# Altium schematic sheet 原理图.SchDoc
size A3
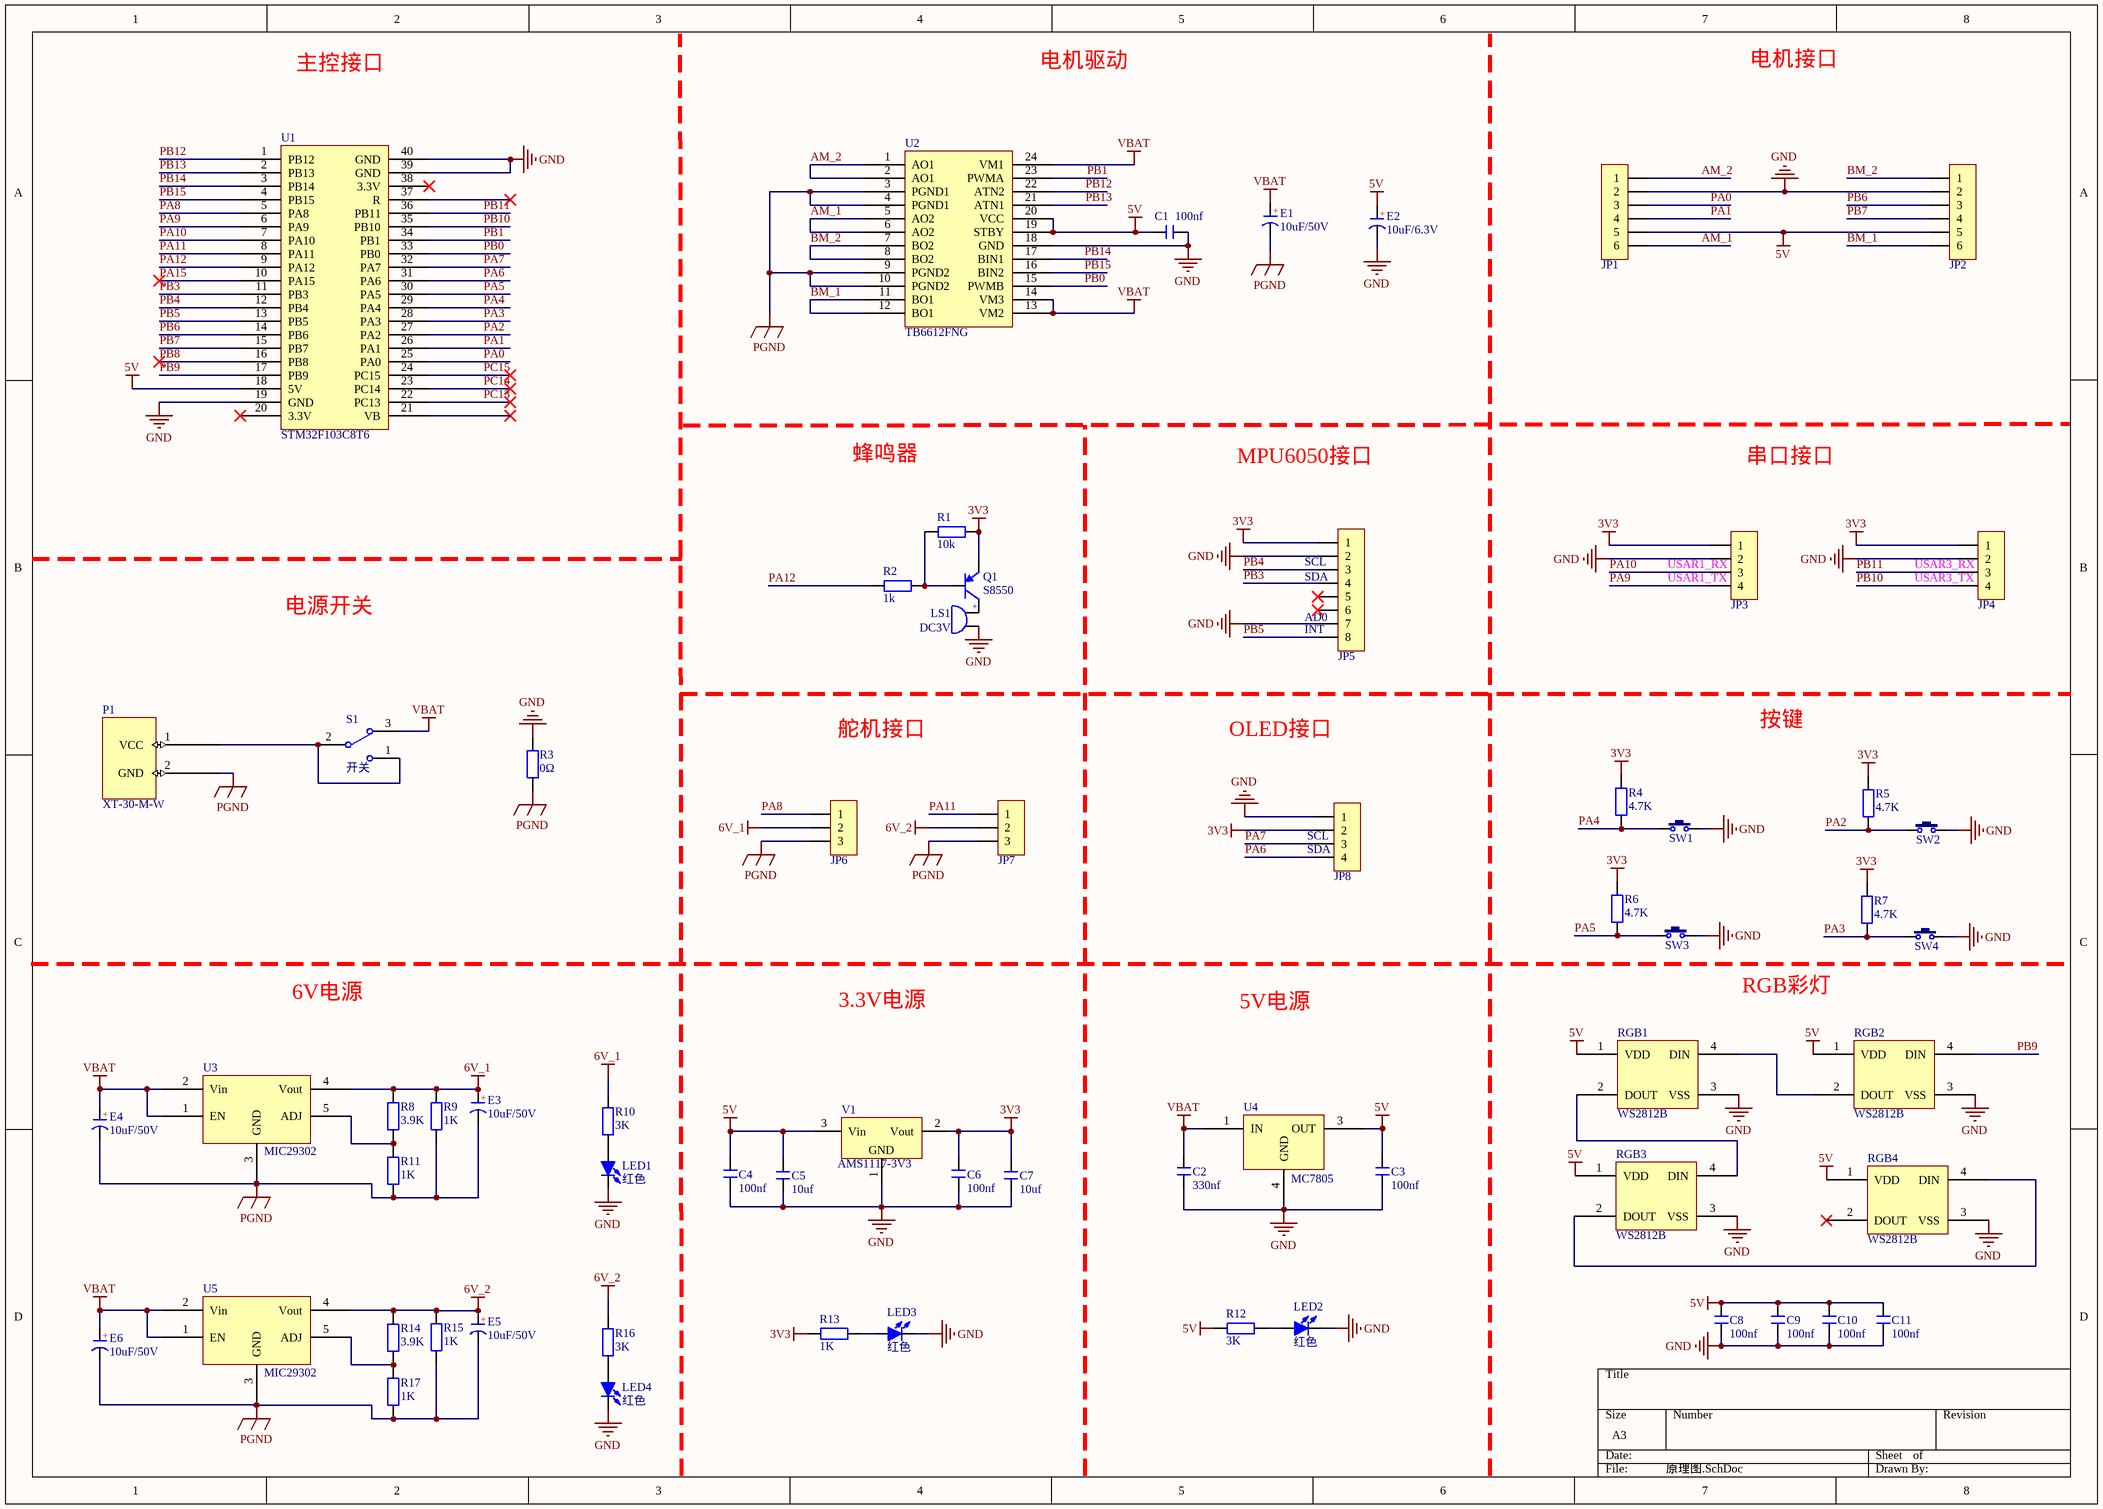
[diagram p0: 原理图.SchDoc]

## Parts
C1  100nf  [C 0805_L]
C2  330nf  [C 0805_L]
C3  100nf  [C 0805_L]
C4  100nf  [C 0805_L]
C5  10uf  [C 0805_L]
C6  100nf  [C 0805_L]
C7  10uf  [C 0805_L]
C8  100nf  [C 0805_L]
C9  100nf  [C 0805_L]
C10  100nf  [C 0805_L]
C11  100nf  [C 0805_L]
E1  10uF/50V  [CM C(5*5.4)]
E2  10uF/6.3V  [CD A(3216)]
E3  10uF/50V  [CS 2.0*5*8 - V]
E4  10uF/50V  [CS 2.0*5*8 - V]
E5  10uF/50V  [CS 2.0*5*8 - V]
E6  10uF/50V  [CS 2.0*5*8 - V]
JP1  HDR-1X6  [XH2.54-WI-6P]  (value not drawn)
JP2  HDR-1X6  [XH2.54-WI-6P]  (value not drawn)
JP3  HDR-1X4  [HDR2.54-M-LI-4P]  (value not drawn)
JP4  HDR-1X4  [HDR2.54-M-LI-4P]  (value not drawn)
JP5  HDR-1X8  [HDR2.54-M-LI-8P]  (value not drawn)
JP6  HDR-1X3  [HDR2.54-LI-3P]  (value not drawn)
JP7  HDR-1X3  [HDR2.54-LI-3P]  (value not drawn)
JP8  HDR-1X4  [HDR2.54-M-LI-4P]  (value not drawn)
LED1  红色  [LED 0603B]
LED2  红色  [LED 0603B]
LED3  红色  [LED 0603B]
LED4  红色  [LED 0603B]
LS1  DC3V  [BEEP 5x9x5.5]
P1  XT-30-M-W  [XT-30-M-W]
Q1  S8550  [SOT23-3N]
R1  10k  [R 0805_L]
R2  1k  [R 0805_L]
R3  0Ω  [R 0805_L]
R4  4.7K  [R 0805_L]
R5  4.7K  [R 0805_L]
R6  4.7K  [R 0805_L]
R7  4.7K  [R 0805_L]
R8  3.9K  [R 0805_L]
R9  1K  [R 0805_L]
R10  3K  [R 0805_L]
R11  1K  [R 0805_L]
R12  3K  [R 0805_L]
R13  1K  [R 0805_L]
R14  3.9K  [R 0805_L]
R15  1K  [R 0805_L]
R16  3K  [R 0805_L]
R17  1K  [R 0805_L]
RGB1  WS2812B  [WS2812B]
RGB2  WS2812B  [WS2812B]
RGB3  WS2812B  [WS2812B]
RGB4  WS2812B  [WS2812B]
S1  开关  [MTS-10x]
SW1  3x6x5  [TSW SMD-3*6*2.5]  (value not drawn)
SW2  3x6x5  [TSW SMD-3*6*2.5]  (value not drawn)
SW3  3x6x5  [TSW SMD-3*6*2.5]  (value not drawn)
SW4  3x6x5  [TSW SMD-3*6*2.5]  (value not drawn)
U1  STM32F103C8T6  [STM32F103C8T6最小系统板3]
U2  TB6612FNG  [SSOP24_L]
U3  MIC29302  [TO-263-5]
U4  MC7805  [TO-263-3]
U5  MIC29302  [TO-263-5]
V1  AMS1117-3V3  [SOT223_L]

## Nets
3V3: C6.2 C7.2 JP3.1 JP4.1 JP5.1 JP8.2 Q1.2(E) R1.1 R4.1 R5.1 R6.1 R7.1 R13.1 V1.2(Vout)
5V: C1.2 C3.2 C4.2 C5.2 C8.2 C9.2 C10.2 C11.2 E2.1(A) JP1.5 JP2.5 R12.1 RGB1.1(VDD) RGB2.1(VDD) RGB3.1(VDD) RGB4.1(VDD) U1.18(5V) U2.19(STBY) U2.20(VCC) U4.3(OUT) V1.3(Vin)
6V_1: E3.1(A) JP6.2 R8.1 R9.1 R10.1 U3.4(Vout)
6V_2: E5.1(A) JP7.2 R14.1 R15.1 R16.1 U5.4(Vout)
GND: C1.1 C2.1 C3.1 C4.1 C5.1 C6.1 C7.1 C8.1 C9.1 C10.1 C11.1 E2.2(K) JP1.2 JP2.2 JP3.2 JP4.2 JP5.2 JP5.7 JP8.1 LED1.2(K) LED2.2(K) LED3.2(K) LED4.2(K) LS1.2 R3.2 RGB1.3(VSS) RGB2.3(VSS) RGB3.3(VSS) RGB4.3(VSS) SW1.2 SW2.2 SW3.2 SW4.2 U1.19(GND) U1.39(GND) U1.40(GND) U2.18(GND) U4.4(GND) V1.1(GND)
PGND: E1.2(K) E3.2(K) E4.2(K) E5.2(K) E6.2(K) JP6.3 JP7.3 P1.2(GND) R3.1 R9.2 R11.1 R15.2 R17.1 U2.3(PGND1) U2.4(PGND1) U2.9(PGND2) U2.10(PGND2) U3.3(GND) U5.3(GND)
VBAT: C2.2 E1.1(A) E4.1(A) E6.1(A) S1.3 U2.13(VM2) U2.14(VM3) U2.24(VM1) U3.1(EN) U3.2(Vin) U4.1(IN) U5.1(EN) U5.2(Vin)
AM_1: JP1.6 U2.5(AO2) U2.6(AO2)
AM_2: JP1.1 U2.1(AO1) U2.2(AO1)
BM_1: JP2.6 U2.11(BO1) U2.12(BO1)
BM_2: JP2.1 U2.7(BO2) U2.8(BO2)
PA0: JP1.3 U1.25(PA0)
PA1: JP1.4 U1.26(PA1)
PA2: R5.2 SW2.1 U1.27(PA2)
PA3: R7.2 SW4.1 U1.28(PA3)
PA4: R4.2 SW1.1 U1.29(PA4)
PA5: R6.2 SW3.1 U1.30(PA5)
PA6: JP8.4 U1.31(PA6)
PA7: JP8.3 U1.32(PA7)
PA8: JP6.1 U1.5(PA8)
PA9: JP3.4 U1.6(PA9)
PA10: JP3.3 U1.7(PA10)
PA11: JP7.1 U1.8(PA11)
PA12: R2.1 U1.9(PA12)
PA15: U1.10(PA15)
PB0: U1.33(PB0) U2.15(PWMB)
PB1: U1.34(PB1) U2.23(PWMA)
PB3: JP5.4 U1.11(PB3)
PB4: JP5.3 U1.12(PB4)
PB5: JP5.8 U1.13(PB5)
PB6: JP2.3 U1.14(PB6)
PB7: JP2.4 U1.15(PB7)
PB8: U1.16(PB8)
PB9: RGB2.4(DIN) U1.17(PB9)
PB10: JP4.4 U1.35(PB10)
PB11: JP4.3 U1.36(PB11)
PB12: U1.1(PB12) U2.22(ATN2)
PB13: U1.2(PB13) U2.21(ATN1)
PB14: U1.3(PB14) U2.17(BIN1)
PB15: U1.4(PB15) U2.16(BIN2)
PC13: U1.22(PC13)
PC14: U1.23(PC14)
PC15: U1.24(PC15)
NetLED1_1: LED1.1(A) R10.2
NetLED2_1: LED2.1(A) R12.2
NetLED3_1: LED3.1(A) R13.2
NetLED4_1: LED4.1(A) R16.2
NetLS1_1: LS1.1 Q1.3(C)
NetP1_1: P1.1(VCC) S1.1 S1.2
NetQ1_1: Q1.1(B) R1.2 R2.2
NetR8_2: R8.2 R11.2 U3.5(ADJ)
NetR14_2: R14.2 R17.2 U5.5(ADJ)
NetRGB1_2: RGB1.2(DOUT) RGB3.4(DIN)
NetRGB1_4: RGB1.4(DIN) RGB2.2(DOUT)
NetRGB3_2: RGB3.2(DOUT) RGB4.4(DIN)

Not connected (* = marked no-connect by the designer): JP5 5* 6*; RGB4 2(DOUT)*; U1 20(3.3V)* 21(VB)* 37(R)* 38(3.3V)*

## Notes on the sheet
- 主控接口
- 电机驱动
- 电机接口
- 蜂鸣器
- MPU6050接口
- 串口接口
- (near JP5) SCL
- (near JP5) SDA
- (near JP3) USAR1_RX
- (near JP3) USAR1_TX
- (near JP4) USAR3_RX
- (near JP4) USAR3_TX
- 电源开关
- (near JP5) AD0
- (near JP5) INT
- 舵机接口
- OLED接口
- 按键
- (near JP8) SCL
- (near JP8) SDA
- 6V电源
- 3.3V电源
- 5V电源
- RGB彩灯
- (in symbol BEEP) +
- (in symbol CE_SMD) +
- (in symbol CT) +

## Library data of the parts
C1-C11 = C: 贴片电容; BOM名称: 无极性贴片电容; 淘宝ID: 封装库来自淘宝 ID：黄晶宝石; 联系售后: https://shop463601444.taobao.com
E1 E3-E6 = CE_SMD: 贴片电解电容; 版权归属: 封装库来自淘宝 ID：黄晶宝石; BOM名称: 贴片电解电容; 联系售后: https://shop463601444.taobao.com
E2 = CT: 贴片钽电容; 淘宝ID: 封装库来自淘宝 ID：黄晶宝石; BOM名称: 贴片钽电容; 联系售后: https://shop463601444.taobao.com
JP1 JP2 = Header 6: 6P接插件; 版权归属: 封装库来自淘宝 ID：黄晶宝石; BOM名称: 6P接插件; 学习资源: https://shop463601444.taobao.com
JP3 JP4 JP8 = Header 4: 4P接插件; 版权归属: 封装库来自淘宝 ID：黄晶宝石; BOM名称: 4P接插件; 学习资源: https://shop463601444.taobao.com
JP5 = Header 8: 8P接插件; 版权归属: 封装库来自淘宝 ID：黄晶宝石; BOM名称: 8P接插件; 学习资源: https://shop463601444.taobao.com
JP6 JP7 = Header 3: 3P接插件; 版权归属: 封装库来自淘宝 ID：黄晶宝石; BOM名称: 3P接插件; 学习资源: https://shop463601444.taobao.com
LED1-LED4 = LED-SMD: 贴片LED; 版权归属: 封装库来自淘宝 ID：黄晶宝石; BOM名称: 贴片LED; 学习资源: https://shop463601444.taobao.com
LS1 = BEEP: 蜂鸣器; 版权归属: 封装库来自淘宝 ID：黄晶宝石; BOM名称: 蜂鸣器; 联系售后: https://shop463601444.taobao.com
P1 = XT-30-M-W: 小电流模型插头XT-30 低阻值香蕉插头_MAX current 30A,公头
Q1 = 8550-SMD: 高频放大-PNP型; 版权归属: 封装库来自淘宝 ID：黄晶宝石; 属性: 40V 1.5A 1W 100MHZ; BOM名称: 高频放大-PNP型; 学习资源: www.ooocke.com
R1-R17 = R: 贴片电阻; 版权归属: 来自淘宝 ID：黄晶宝石; BOM名称: 贴片电阻; 联系售后: https://shop463601444.taobao.com
RGB1-RGB4 = RGB_WS2812B_4Pin
S1 = 拨动开关（三脚）
SW1-SW4 = TSW 3x6: 3x6轻触开关; 版权归属: 封装库来自淘宝 ID：黄晶宝石; BOM名称: 3x6轻触开关; 学习资源: www.ooocke.com
U1 = STM32F103C8T6最小系统板
V1 = AMS1117: 三端稳压芯片; BOM名称: 稳压芯片; 淘宝ID: 封装库来自淘宝 ID：黄晶宝石; 欢迎光临淘宝店铺: https://shop463601444.taobao.com